# EAGLE schematic 2020can_master_v6 (EAGLE 9.6.2)
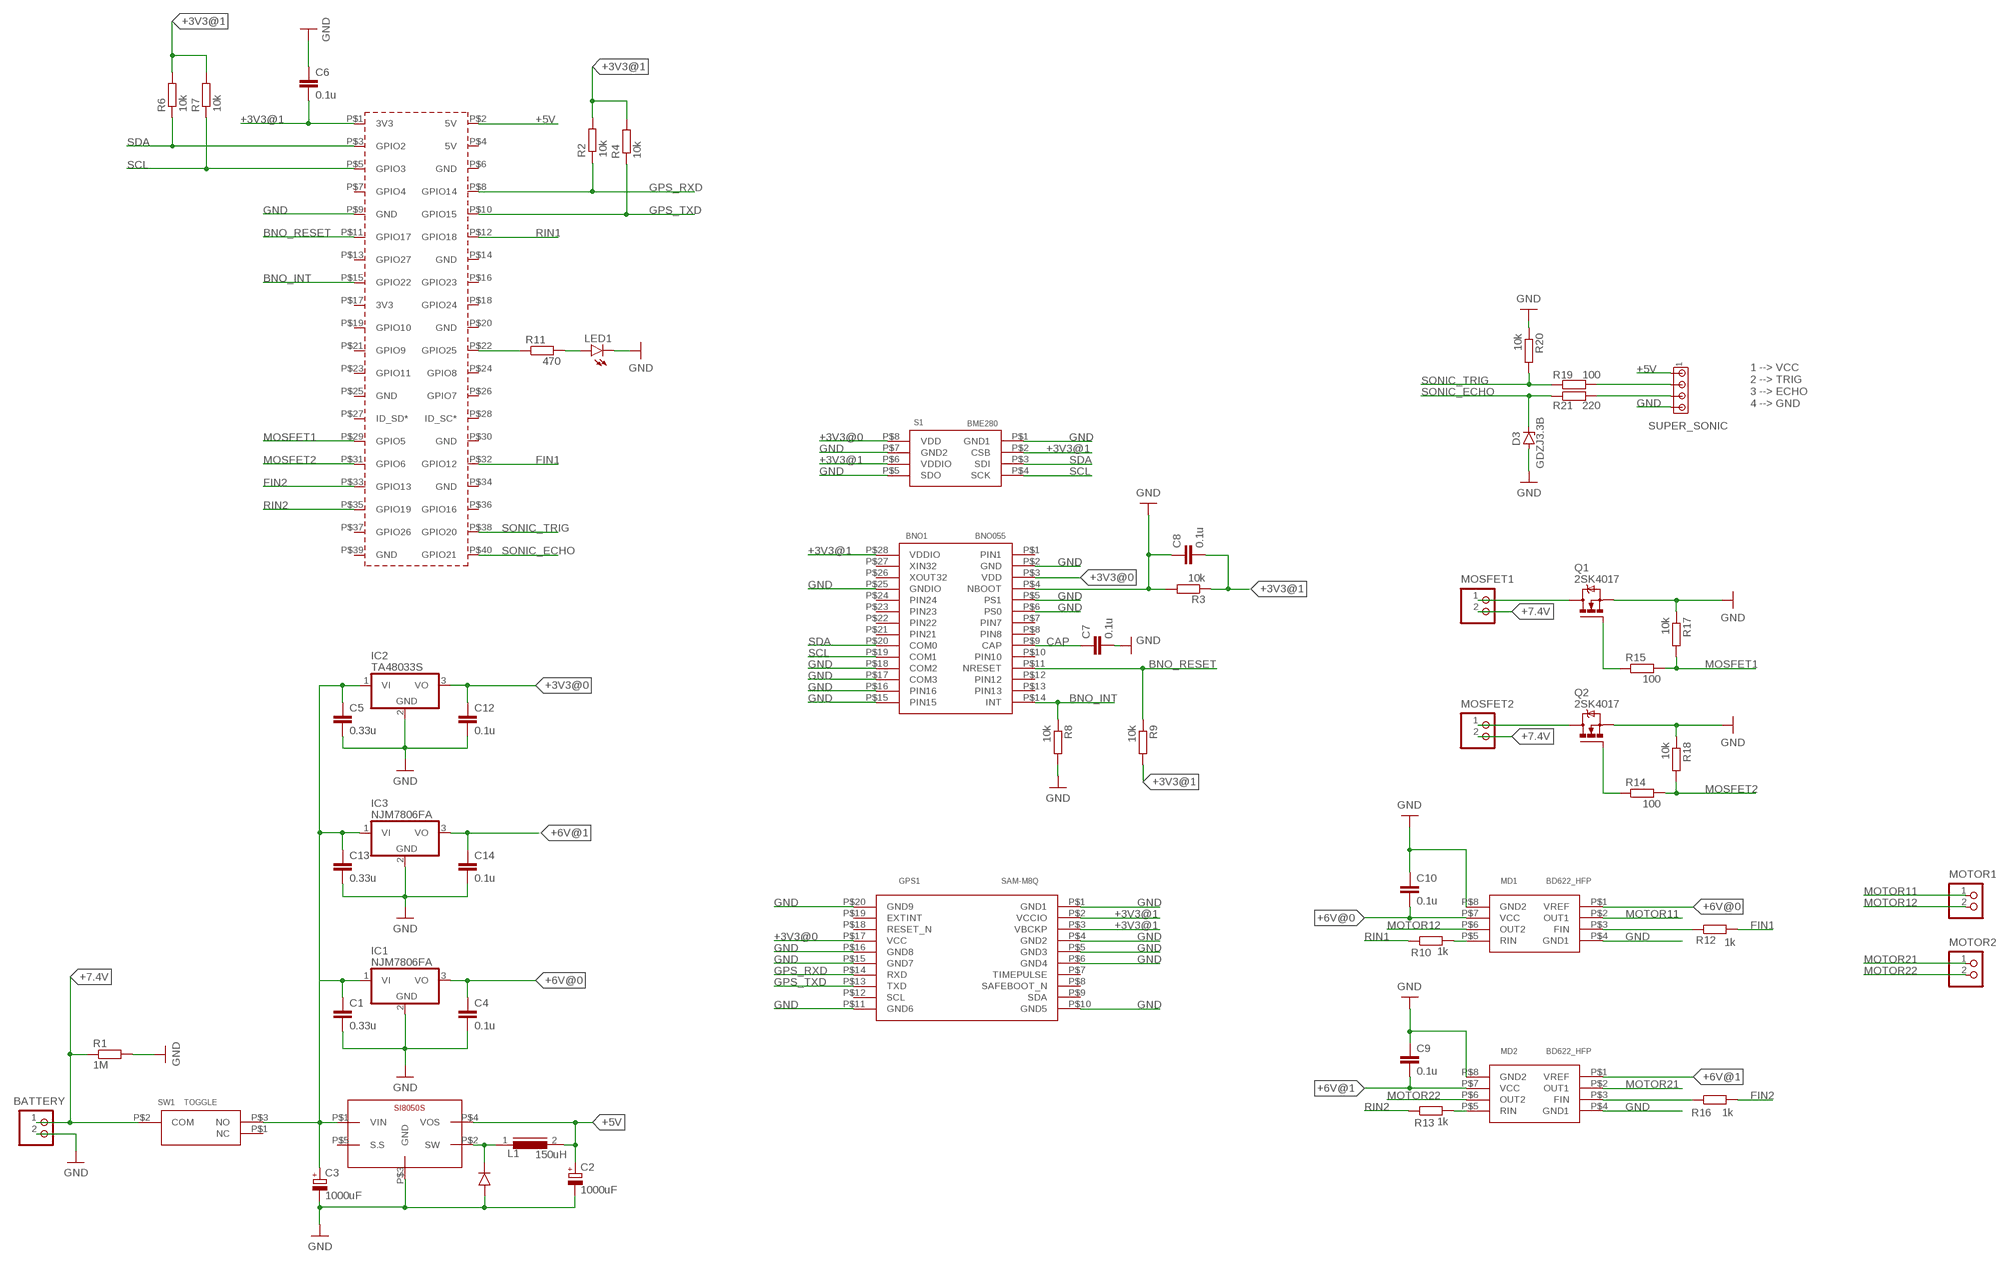
[diagram p0: schematic, sheet 1]

## Parts
BATTERY  B2P-VH  [B2P-VH]
BNO1  BNO055  [BNO055]
C1  0.33u  C5/3  [C5B3]
C2  1000uF  CPOL-EUE5-10.5  [E5-10,5]
C3  1000uF  CPOL-EUE5-10.5  [E5-10,5]
C4  0.1u  C5/3  [C5B3]
C5  0.33u  C5/3  [C5B3]
C6  0.1u  C-EUC1608  [C1608]
C7  0.1u  C-EUC1608  [C1608]
C8  0.1u  C-EUC1608  [C1608]
C9  0.1u  C-EUC1608  [C1608]
C10  0.1u  C-EUC1608  [C1608]
C12  0.1u  C5/3  [C5B3]
C13  0.33u  C5/3  [C5B3]
C14  0.1u  C5/3  [C5B3]
D3  GDZJ3.3B  1N821  [DO35Z10]
DIODE_1.1  DIODE_1.5  [DIODE_1.5]
GPS1  SAM-M8Q  [SAM-M8Q]
IC1  NJM7806FA  786TV  [TO220V]
IC2  TA48033S  786TV  [TO220V]
IC3  NJM7806FA  786TV  [TO220V]
L1  150uH  SFT830D  [SFT830D]
LED1  LED5MM  [LED5MM]
MD1  BD622_HFP  [BD62**_HRP7]
MD2  BD622_HFP  [BD62**_HRP7]
MOSFET1  B2P-VH  [B2P-VH]
MOSFET2  B2P-VH  [B2P-VH]
MOTOR1  B2P-VH  [B2P-VH]
MOTOR2  B2P-VH  [B2P-VH]
PCB1  RPI3RPI3  [RPI3]
Q1  2SK4017  IRF520  [TO220BV]
Q2  2SK4017  IRF520  [TO220BV]
R1  1M  R-EU_R2012  [R2012]
R2  10k  R-EU_R2012  [R2012]
R3  10k  R-EU_R2012  [R2012]
R4  10k  R-EU_R2012  [R2012]
R6  10k  R-EU_R2012  [R2012]
R7  10k  R-EU_R2012  [R2012]
R8  10k  R-EU_R2012  [R2012]
R9  10k  R-EU_R2012  [R2012]
R10  1k  R-EU_R2012  [R2012]
R11  470  R-EU_0207/10  [0207/10]
R12  1k  R-EU_R2012  [R2012]
R13  1k  R-EU_R2012  [R2012]
R14  100  R-EU_0207/10  [0207/10]
R15  100  R-EU_0207/10  [0207/10]
R16  1k  R-EU_R2012  [R2012]
R17  10k  R-EU_R2012  [R2012]
R18  10k  R-EU_R2012  [R2012]
R19  100  R-EU_0207/10  [0207/10]
R20  10k  R-EU_R2012  [R2012]
R21  220  R-EU_0207/10  [0207/10]
S1  BME280  [BME280]
SI8050S1  SI8050S  [SI8050S]
SUPER_SONIC  MTA04-100  [10X04MTA]
SW1  TOGGLE  TOGGLE_1MS1-T1-B1-M2-Q-N-S  [TOGGLE_1MS1-T1-B1-M2-Q-N-S]

## Nets
+3V3@0 [sensor]: BNO1.P$3(VDD) C12.1 GPS1.P$17(VCC) IC2.3(VO) S1.P$8(VDD)
+3V3@1 [sensor]: BNO1.P$28(VDDIO) C6.2 C8.2 GPS1.P$2(VCCIO) GPS1.P$3(VBCKP) PCB1.P$1(3V3) R2.2 R3.1 R4.2 R6.2 R7.2 R9.2 S1.P$2(CSB) S1.P$6(VDDIO)
+5V [power]: C2.+ L1.2 PCB1.P$2(5V) SI8050S1.P$4(VOS) SUPER_SONIC.1
+6V@0 [motor]: C4.1 C10.2 IC1.3(VO) MD1.P$1(VREF) MD1.P$7(VCC)
+6V@1 [motor]: C9.2 C14.1 IC3.3(VO) MD2.P$1(VREF) MD2.P$7(VCC)
+7.4V [power]: BATTERY.1 MOSFET1.2 MOSFET2.2 R1.1 SW1.P$2(COM)
BNO_INT [signal]: BNO1.P$14(INT) PCB1.P$15(GPIO22) R8.1
BNO_RESET [signal]: BNO1.P$11(NRESET) PCB1.P$11(GPIO17) R9.1
CAP [signal]: BNO1.P$9(CAP) C7.1
FIN1 [signal]: PCB1.P$32(GPIO12) R12.2
FIN2 [signal]: PCB1.P$33(GPIO13) R16.2
GND: BATTERY.2 BNO1.P$2(GND) BNO1.P$4(NBOOT) BNO1.P$5(PS1) BNO1.P$6(PS0) BNO1.P$15(PIN15) BNO1.P$16(PIN16) BNO1.P$17(COM3) BNO1.P$18(COM2) BNO1.P$25(GNDIO) C1.2 C2.- C3.- C4.2 C5.2 C6.1 C7.2 C8.1 C9.1 C10.1 C12.2 D3.A DIODE_1.1.P$1(ANODE) GPS1.P$1(GND1) GPS1.P$4(GND2) GPS1.P$5(GND3) GPS1.P$6(GND4) GPS1.P$10(GND5) GPS1.P$11(GND6) GPS1.P$15(GND7) GPS1.P$16(GND8) GPS1.P$20(GND9) IC1.2(GND) IC2.2(GND) LED1.K(C) MD1.P$4(GND1) MD1.P$8(GND2) MD2.P$4(GND1) MD2.P$8(GND2) PCB1.P$9(GND) Q1.S Q2.S R1.2 R3.2 R8.2 R17.1 R18.1 R20.1 S1.P$1(GND1) S1.P$5(SDO) S1.P$7(GND2) SI8050S1.P$3(GND) SUPER_SONIC.4
GPS_RXD [signal]: GPS1.P$14(RXD) PCB1.P$8(GPIO14) R2.1
GPS_TXD [signal]: GPS1.P$13(TXD) PCB1.P$10(GPIO15) R4.1
MOSFET1 [signal]: PCB1.P$29(GPIO5) R15.2 R17.2
MOSFET2 [signal]: PCB1.P$31(GPIO6) R14.2 R18.2
MOTOR11 [motor]: MD1.P$2(OUT1) MOTOR1.1
MOTOR12 [motor]: MD1.P$6(OUT2) MOTOR1.2
MOTOR21 [motor]: MD2.P$2(OUT1) MOTOR2.1
MOTOR22 [motor]: MD2.P$6(OUT2) MOTOR2.2
N$2 [motor]: DIODE_1.1.P$2(CATHODE) L1.1 SI8050S1.P$2(SW)
N$3 [signal]: PCB1.P$22(GPIO25) R11.1
N$4 [power]: C1.1 C3.+ C5.1 C13.1 IC1.1(VI) IC2.1(VI) IC3.1(VI) SI8050S1.P$1(VIN) SW1.P$3(NO)
N$5: LED1.A R11.2
N$6 [mos]: MOSFET1.1 Q1.D
N$7: MD1.P$3(FIN) R12.1
N$8 [mos]: MOSFET2.1 Q2.D
N$9: MD1.P$5(RIN) R10.2
N$10: Q1.G R15.1
N$11: Q2.G R14.1
N$12: MD2.P$3(FIN) R16.1
N$13: C13.2 C14.2 IC3.2(GND)
N$14: MD2.P$5(RIN) R13.2
N$15: R19.2 SUPER_SONIC.2
N$16: R21.2 SUPER_SONIC.3
RIN1 [signal]: PCB1.P$12(GPIO18) R10.1
RIN2 [signal]: PCB1.P$35(GPIO19) R13.1
SCL [signal]: BNO1.P$19(COM1) PCB1.P$5(GPIO3) R7.1 S1.P$4(SCK)
SDA [signal]: BNO1.P$20(COM0) PCB1.P$3(GPIO2) R6.1 S1.P$3(SDI)
SONIC_ECHO [signal]: D3.C PCB1.P$40(GPIO21) R21.1
SONIC_TRIG [signal]: PCB1.P$38(GPIO20) R19.1 R20.2
Unconnected: BNO1.P$1(PIN1) BNO1.P$7(PIN7) BNO1.P$8(PIN8) BNO1.P$10(PIN10) BNO1.P$12(PIN12) BNO1.P$13(PIN13) BNO1.P$21(PIN21) BNO1.P$22(PIN22) BNO1.P$23(PIN23) BNO1.P$24(PIN24) BNO1.P$26(XOUT32) BNO1.P$27(XIN32) GPS1.P$7(TIMEPULSE) GPS1.P$8(SAFEBOOT_N) GPS1.P$9(SDA) GPS1.P$12(SCL) GPS1.P$18(RESET_N) GPS1.P$19(EXTINT) PCB1.P$4(5V) PCB1.P$6(GND) PCB1.P$7(GPIO4) PCB1.P$13(GPIO27) PCB1.P$14(GND) PCB1.P$16(GPIO23) PCB1.P$17(3V3) PCB1.P$18(GPIO24) PCB1.P$19(GPIO10) PCB1.P$20(GND) PCB1.P$21(GPIO9) PCB1.P$23(GPIO11) PCB1.P$24(GPIO8) PCB1.P$25(GND) PCB1.P$26(GPIO7) PCB1.P$27(ID_SD*) PCB1.P$28(ID_SC*) PCB1.P$30(GND) PCB1.P$34(GND) PCB1.P$36(GPIO16) PCB1.P$37(GPIO26) PCB1.P$39(GND) SI8050S1.P$5(S.S) SW1.P$1(NC)

## Notes on the sheet
- 1 --> VCC
  2 --> TRIG
  3 --> ECHO
  4 --> GND

## Library data of the parts
BATTERY MOSFET1 MOSFET2 MOTOR1 MOTOR2 = CONN_VH:B2P-VH: Wire-to-Board 3.96mm pitch top mount connector Source: http://www.jst-mfg.com/product/pdf/jpn/VH.pdf http://www.jst-mfg.com/product/detail.php?series=262
BNO1 = BNO055:BNO055
C1 C4 C5 C12-C14 = capacitor-wima:C: CAPACITOR naming: grid - package width
C2 C3 = resistor:CPOL-EU: POLARIZED CAPACITOR, European symbol
C6-C10 = rcl:C-EU: CAPACITOR, European symbol; SPICEPREFIX: C
D3 = diode:1N821: Reference DIODE temperature compensated, 6,2 V
DIODE_1.1 = diode_1.5mm:DIODE_1.5
GPS1 = GPS:SAM-M8Q
IC1-IC3 = linear:78*: Positive VOLTAGE REGULATOR Source: http://cache.national.com/ds/LM/LM78L05.pdf http://www.fairchildsemi.com/ds/LM/LM7805.pdf
L1 = inductors:SFT830D: INDUCTOR; SPICEPREFIX: L
LED1 = led:LED: LED OSRAM: - CHIPLED LG R971, LG N971, LY N971, LG Q971, LY Q971, LO R971, LY R971 LH N974, LH R974 LS Q976, LO Q976, LY Q976 LO Q996 - Hyper CHIPLED LW Q18S LB Q993, LB Q99A, LB R99A - SideLED LS A670, LO A670, LY A670, LG A670, LP A670 LB A673, LV A673, LT A673, LW A673 LH A674 LY A675 LS A676, LA A676, LO A676, LY A676, LW A676 LS A679, LY A679, LG A679 - Hyper Micro SIDELED® LS Y876, LA Y876, LO Y876, LY Y876 LT Y87S - SmartLED LW L88C, LW L88S LB L89C, LB L89S, LG L890 LS L89K, LO L89K, LY L89K LS L896, LA L896, LO L896, LY L896 - TOPLED LS T670, LO T670, LY T670, LG T670, LP T670 LSG T670, LSP T670, LSY T670, LOP T670, LYG T670 LG T671, LOG T671, LSG T671 LB T673, LV T673, LT T673, LW T673 LH T674 LS T676, LA T676, LO T676, LY T676, LB T676, LH T676, LSB T676, LW T676 LB T67C, LV T67C, LT T67C, LS T67K, LO T67K, LY T67K, LW E67C LS E67B, LA E67B, LO E67B, LY E67B, LB E67C, LV E67C, LT E67C LW T67C LS T679, LY T679, LG T679 LS T770, LO T770, LY T770, LG T770, LP T770 LB T773, LV T773, LT T773, LW T773 LH T774 LS E675, LA E675, LY E675, LS T675 LS T776, LA T776, LO T776, LY T776, LB T776 LHGB T686 LT T68C, LB T68C - Hyper Mini TOPLED® LB M676 - Mini TOPLED Santana® LG M470 LS M47K, LO M47K, LY M47K Source: http://www.osram.convergy.de LUXEON: - LUMILED® LXK2-PW12-R00, LXK2-PW12-S00, LXK2-PW14-U00, LXK2-PW14-V00 LXK2-PM12-R00, LXK2-PM12-S00, LXK2-PM14-U00 LXK2-PE12-Q00, LXK2-PE12-R00, LXK2-PE12-S00, LXK2-PE14-T00, LXK2-PE14-U00 LXK2-PB12-K00, LXK2-PB12-L00, LXK2-PB12-M00, LXK2-PB14-N00, LXK2-PB14-P00, LXK2-PB14-Q00 LXK2-PR12-L00, LXK2-PR12-M00, LXK2-PR14-Q00, LXK2-PR14-R00 LXK2-PD12-Q00, LXK2-PD12-R00, LXK2-PD12-S00 LXK2-PH12-R00, LXK2-PH12-S00 LXK2-PL12-P00, LXK2-PL12-Q00, LXK2-PL12-R00 Source: www.luxeon.com KINGBRIGHT: KA-3528ASYC Source: www.kingbright.com
MD1 MD2 = BD62_:BD622*_HFP
PCB1 = Raspberry Pi 3 model B:RPI3: Device for Raspberry Pi 3 board created by Dave Young for www.element14.com More information and support community is available at https://www.element14.com/community/community/raspberry-pi Device for Raspberry Pi 3 board updated by Gerald Schwarz for www.element14.com On RPI3 addet the layer milling and created a mirrored shield.
Q1 Q2 = transistor-power:IRF520: HEXFET Power MOSFET
R1-R4 R6-R21 = rcl:R-EU_: RESISTOR, European symbol; SPICEPREFIX: R
S1 = BME280:BME280
SI8050S1 = SI-8050S:SI8050S
SUPER_SONIC = con-amp:MTA04-100: AMP connector
SW1 = switch:TOGGLE_1MS1-T1-B1-M2-Q-N-S

## Net classes
0 default: width 0.2 mm, clearance 0.05 mm
1 power: width 1.5 mm, clearance 0.2 mm
2 mos: width 1.5 mm, clearance 0.2 mm
3 signal: width 0.2 mm, clearance 0.05 mm
4 motor: width 0.8 mm, clearance 0.1 mm
5 sensor: width 0.3 mm, clearance 0.05 mm